# Altium schematic sheet SPECTRE_ESP32-S3.SchDoc
size A3; SheetNumber: 1; SheetTotal: 2
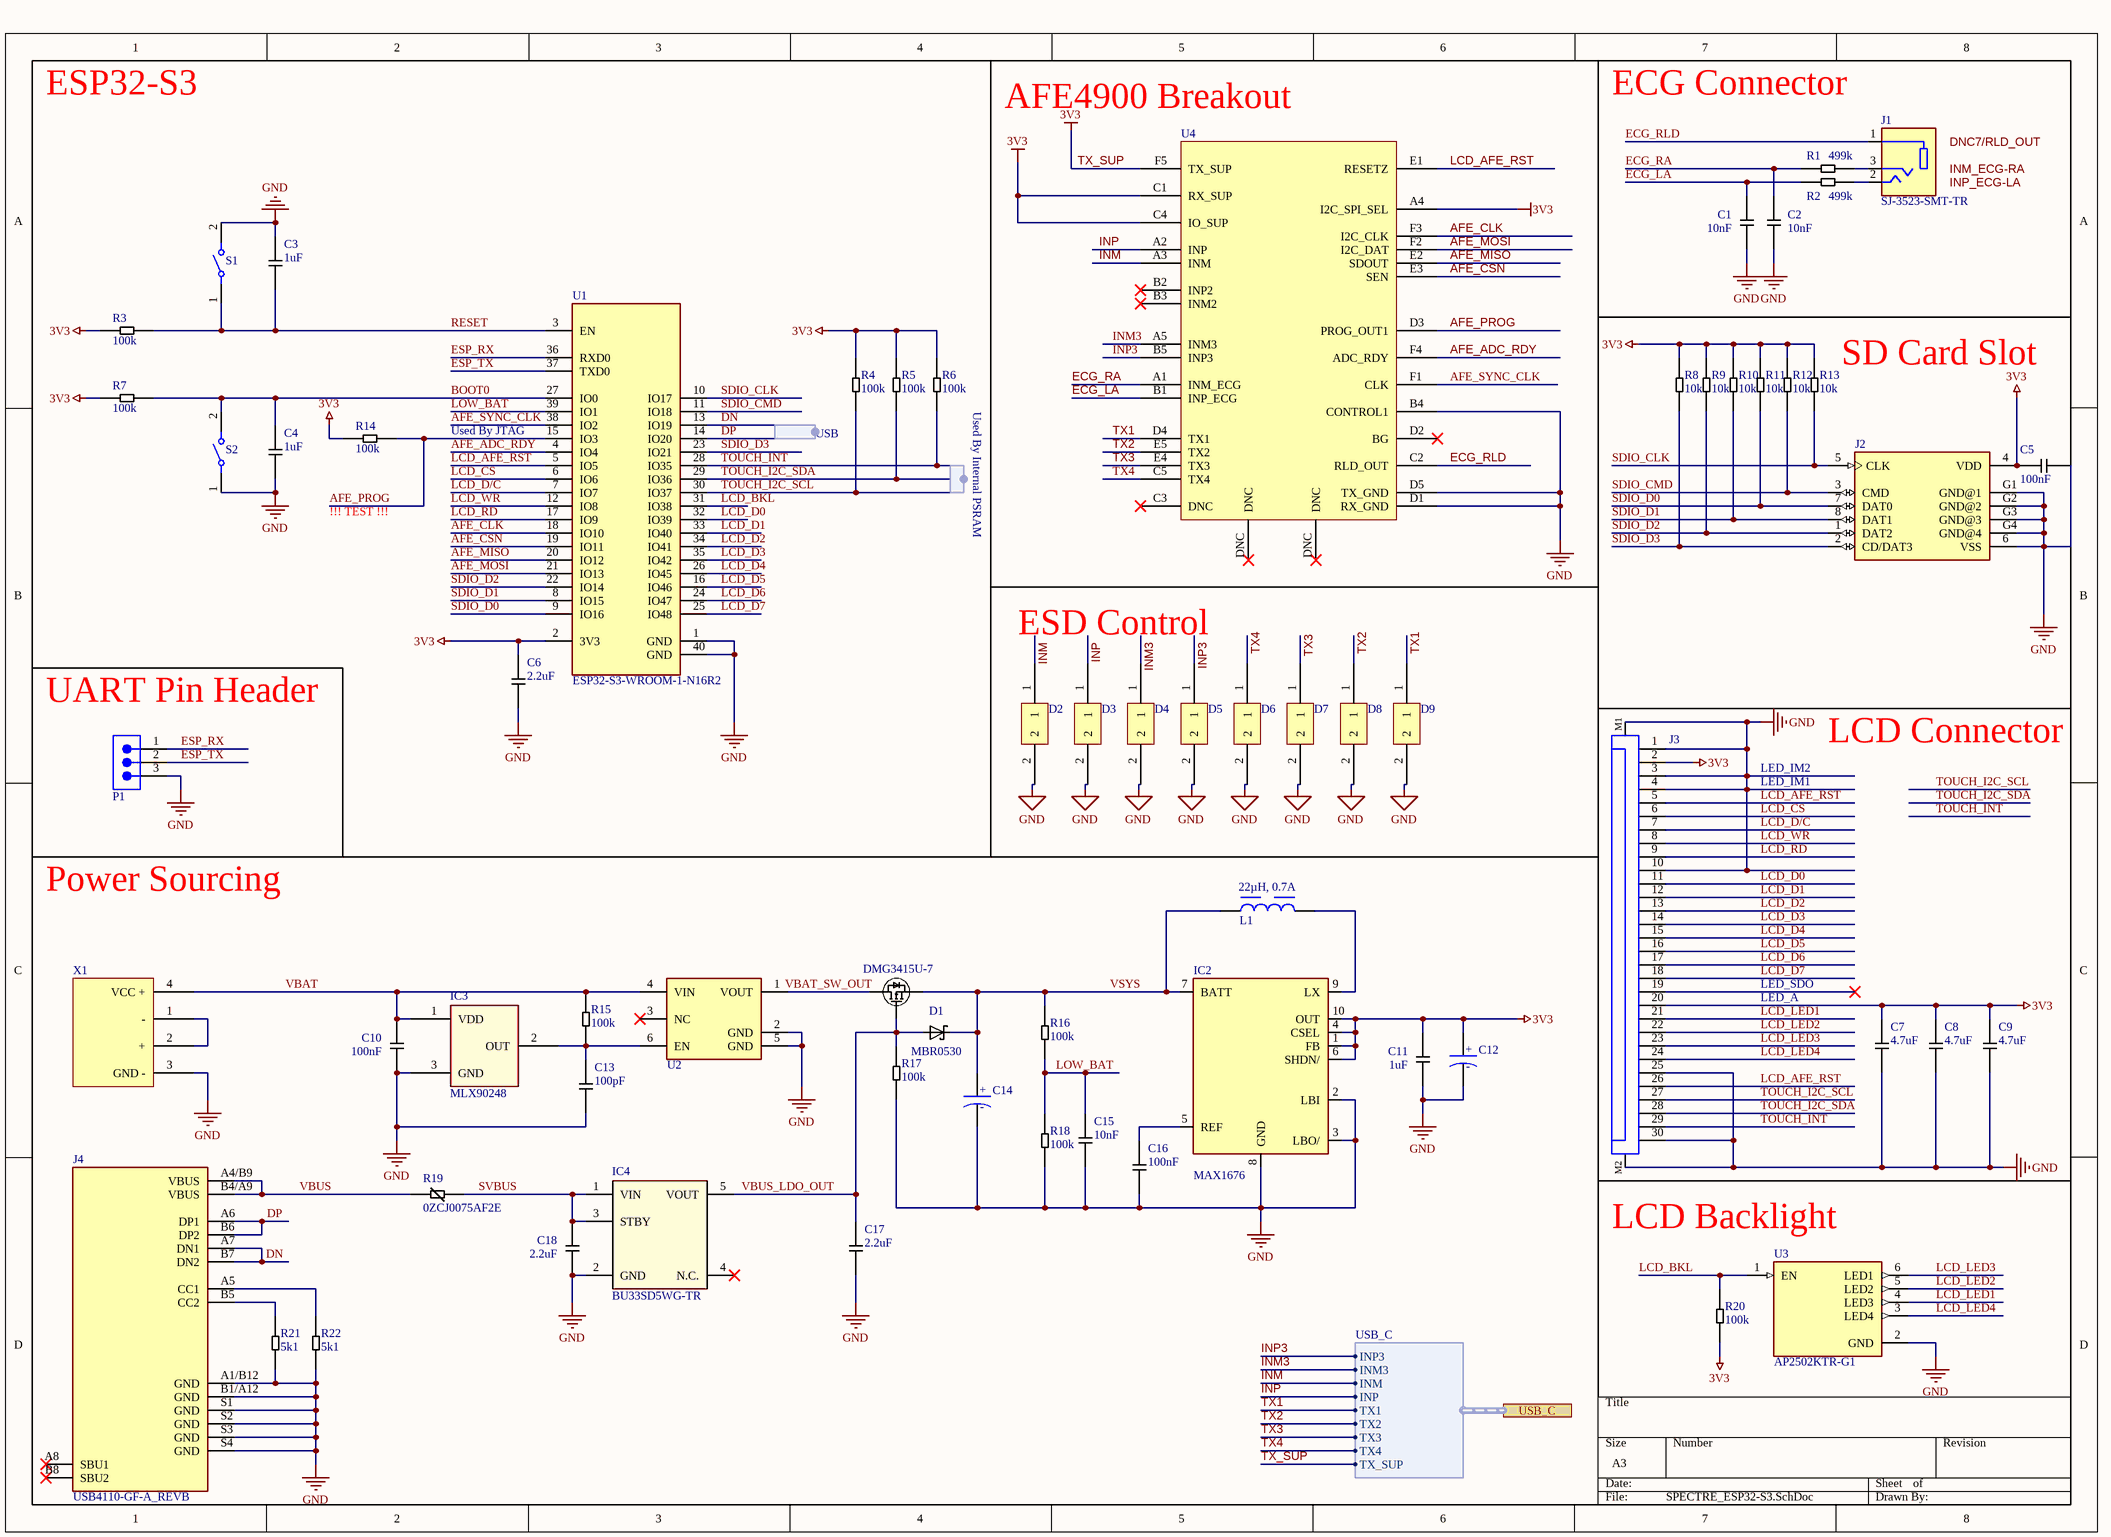
[diagram p0: SPECTRE_ESP32-S3.SchDoc]

## Parts
C1  10nF  [C_0402]
C2  10nF  [C_0402]
C3  1uF  [C_0402]
C4  1uF  [C_0402]
C5  100nF  [C_0402]
C6  2.2uF  [C_0402]
C7  4.7uF  [C_0402]
C8  4.7uF  [C_0402]
C9  4.7uF  [C_0402]
C10  100nF  [C_0402]
C11  1uF  [C_0402]
C12  TAJB476M006RNJ  [TANTAL_1210]  (value not drawn)
C13  100pF  [C_0402]
C14  TAJB476M006RNJ  [TANTAL_1210]  (value not drawn)
C15  10nF  [C_0402]
C16  100nF  [C_0402]
C17  2.2uF  [C_0402]
C18  2.2uF  [C_0402]
D1  MBR0530  [MBR0530]
D2  (no value)  [TPD1E10B06DPYR_0402 - duplicate]
D3  TPD1E10B06DPYR  [TPD1E10B06DPYR_0402 - duplicate]  (value not drawn)
D4  TPD1E10B06DPYR  [TPD1E10B06DPYR_0402 - duplicate]  (value not drawn)
D5  TPD1E10B06DPYR  [TPD1E10B06DPYR_0402 - duplicate]  (value not drawn)
D6  TPD1E10B06DPYR  [TPD1E10B06DPYR_0402 - duplicate]  (value not drawn)
D7  TPD1E10B06DPYR  [TPD1E10B06DPYR_0402 - duplicate]  (value not drawn)
D8  TPD1E10B06DPYR  [TPD1E10B06DPYR_0402 - duplicate]  (value not drawn)
D9  TPD1E10B06DPYR  [TPD1E10B06DPYR_0402 - duplicate]  (value not drawn)
FET1  DMG3415U-7  [SOT95P240X105-3N]
IC2  MAX1676  [UMAX10]
IC3  MLX90248  [SOT95P240X105-3N]
IC4  BU33SD5WG-TR  [SOT95P280X125-5N]
J1  SJ-3523-SMT-TR  [CUI_SJ-3523-SMT-TR]
J2  (no value)  [MOLEX_47219-2001]
J3  687130182122  [687130182122]  (value not drawn)
J4  USB4110-GF-A_REVB  [GCT_USB4110-GF-A_REVB]
L1  22µH, 0.7A  [WE-LQS_4018]
P1  61300311021  [61300311021]  (value not drawn)
R1  499k  [R_0402]
R2  499k  [R_0402]
R3  100k  [R_0402]
R4  100k  [R_0402]
R5  100k  [R_0402]
R6  100k  [R_0402]
R7  100k  [R_0402]
R8  10k  [R_0402]
R9  10k  [R_0402]
R10  10k  [R_0402]
R11  10k  [R_0402]
R12  10k  [R_0402]
R13  10k  [R_0402]
R14  100k  [R_0402]
R15  100k  [R_0402]
R16  100k  [R_0402]
R17  100k  [R_0402]
R18  100k  [R_0402]
R19  0ZCJ0075AF2E  [RESC3216X125N]
R20  100k  [R_0402]
R21  5k1  [R_0402]
R22  5k1  [R_0402]
S1  434153017835  [434153017835]  (value not drawn)
S2  434153017835  [434153017835]  (value not drawn)
U1  ESP32-S3-WROOM-1-N16R2  [XCVR_ESP32-S3-WROOM-1-N16R2]
U2  MIC94090YC6-TR  [Microchip_SC70-6LD-PL-1_IPC_C]  (value not drawn)
U3  AP2502KTR-G1  [SOT95P280X145-6N]
U4  (no value)  [CON - PLCC32 Fassung]
X1  SMT Battery Holder 2 Cells  [SMT Battery Holder]  (value not drawn)

## Ports
USB_C (harness USB_C)

## Harnesses
?: 
USB_C: INP, INM, INM3, INP3, TX4, TX1, TX3, TX2, TX_SUP

## Nets
GND: C1.2 C2.1 C3.2 C4.1 C5.1 C6.1 C7.1 C8.1 C9.1 C10.2 C11.1 C12.NEG C13.1 C14.NEG C15.1 C16.2 C17.1 C18.1 D2.2 D3.2 D4.2 D5.2 D6.2 D7.2 D8.2 D9.2 IC2.2(LBI) IC2.3(LBO/) IC2.8(GND) IC3.3(GND) IC4.2(GND) J2.6(VSS) J2.G1(GND@1) J2.G2(GND@2) J2.G3(GND@3) J2.G4(GND@4) J3.1 J3.3 J3.4 J3.10 J3.25 J3.30 J3.M1 J3.M2 J4.A1/B12(GND) J4.B1/A12(GND) J4.S1(GND) J4.S2(GND) J4.S3(GND) J4.S4(GND) P1.3 R17.1 R18.1 R21.1 R22.1 S1.2 S2.1 U1.1(GND) U1.40(GND) U2.2(GND) U2.5(GND) U3.2(GND) U4.B4(CONTROL1) U4.D1(RX_GND) U4.D5(TX_GND) X1.3(GND_-)
TX_SUP: C5.2 C6.2 C7.2 C8.2 C9.2 C11.2 C12.POS IC2.1(FB) IC2.4(CSEL) IC2.6(SHDN/) IC2.10(OUT) J2.4(VDD) J3.2 J3.20 R3.1 R4.2 R5.2 R6.2 R7.1 R8.2 R9.2 R10.2 R11.2 R12.2 R13.2 R14.1 R20.2 U1.2(3V3) U4.A4(I2C_SPI_SEL) U4.C1(RX_SUP) U4.C4(IO_SUP) U4.F5(TX_SUP) ; port USB_C.TX_SUP  [also labelled 3V3]
AFE_ADC_RDY: U1.4(IO4) U4.F4(ADC_RDY)
AFE_CLK: U1.18(IO10) U4.F3(I2C_CLK)
AFE_CSN: U1.19(IO11) U4.E3(SEN)
AFE_MISO: U1.20(IO12) U4.E2(SDOUT)
AFE_MOSI: U1.21(IO13) U4.F2(I2C_DAT)
AFE_PROG: R14.2 U1.15(IO3) U4.D3(PROG_OUT1)
AFE_SYNC_CLK: U1.38(IO2) U4.F1(CLK)
BOOT0: C4.2 R7.2 S2.2 U1.27(IO0)
DN: J4.A7(DN1) J4.B7(DN2) U1.13(IO19)
DP: J4.A6(DP1) J4.B6(DP2) U1.14(IO20)
ECG_LA: C1.1 R2.2 U4.B1(INP_ECG)
ECG_RA: C2.2 R1.2 U4.A1(INM_ECG)
ECG_RLD: J1.1 U4.C2(RLD_OUT)
ESP_RX: P1.1 U1.36(RXD0)
ESP_TX: P1.2 U1.37(TXD0)
INM: D2.1 U4.A3(INM) ; port USB_C.INM
INM3: D4.1 U4.A5(INM3) ; port USB_C.INM3
INP: D3.1 U4.A2(INP) ; port USB_C.INP
INP3: D5.1 U4.B5(INP3) ; port USB_C.INP3
LCD_AFE_RST: J3.5 J3.26 U1.5(IO5) U4.E1(RESETZ)
LCD_BKL: R20.1 U1.31(IO38) U3.1(EN)
LCD_CS: J3.6 U1.6(IO6)
LCD_D0: J3.11 U1.32(IO39)
LCD_D1: J3.12 U1.33(IO40)
LCD_D2: J3.13 U1.34(IO41)
LCD_D3: J3.14 U1.35(IO42)
LCD_D4: J3.15 U1.26(IO45)
LCD_D5: J3.16 U1.16(IO46)
LCD_D6: J3.17 U1.24(IO47)
LCD_D7: J3.18 U1.25(IO48)
LCD_D/C: J3.7 U1.7(IO7)
LCD_LED1: J3.21 U3.4(LED3)
LCD_LED2: J3.22 U3.5(LED2)
LCD_LED3: J3.23 U3.6(LED1)
LCD_LED4: J3.24 U3.3(LED4)
LCD_RD: J3.9 U1.17(IO9)
LCD_WR: J3.8 U1.12(IO8)
LOW_BAT: C15.2 R16.1 R18.2 U1.39(IO1)
RESET: C3.1 R3.2 S1.1 U1.3(EN)
SDIO_CLK: J2.5(CLK) R13.1 U1.10(IO17)
SDIO_CMD: J2.3(CMD) R12.1 U1.11(IO18)
SDIO_D0: J2.7(DAT0) R11.1 U1.9(IO16)
SDIO_D1: J2.8(DAT1) R10.1 U1.8(IO15)
SDIO_D2: J2.1(DAT2) R9.1 U1.22(IO14)
SDIO_D3: J2.2(CD/DAT3) R8.1 U1.23(IO21)
SVBUS: C18.2 IC4.1(VIN) IC4.3(STBY) R19.2
TOUCH_I2C_SCL: J3.27 R4.1 U1.30(IO37)
TOUCH_I2C_SDA: J3.28 R5.1 U1.29(IO36)
TOUCH_INT: J3.29 R6.1 U1.28(IO35)
TX1: D9.1 U4.D4(TX1) ; port USB_C.TX1
TX2: D8.1 U4.E5(TX2) ; port USB_C.TX2
TX3: D7.1 U4.E4(TX3) ; port USB_C.TX3
TX4: D6.1 U4.C5(TX4) ; port USB_C.TX4
VBAT: C10.1 IC3.1(VDD) R15.2 U2.4(VIN) X1.4(VCC_+)
VBAT_SW_OUT: FET1.3(D) U2.1(VOUT)
VBUS: J4.A4/B9(VBUS) J4.B4/A9(VBUS) R19.1
VBUS_LDO_OUT: C17.2 D1.A FET1.1(G) IC4.5(VOUT) R17.2
VSYS: C14.POS D1.C FET1.2(S) IC2.7(BATT) L1.1 R16.2
NetC13_2: C13.2 IC3.2(OUT) R15.1 U2.6(EN)
NetC16_1: C16.1 IC2.5(REF)
NetIC2_9: IC2.9(LX) L1.2
NetJ1_2: J1.2 R2.1
NetJ1_3: J1.3 R1.1
NetJ4_A5: J4.A5(CC1) R22.2
NetJ4_B5: J4.B5(CC2) R21.2
NetX1_1: X1.1(-) X1.2(+)

Not connected (* = marked no-connect by the designer): IC4 4(N.C.)*; J3 19*; J4 A8(SBU1)* B8(SBU2)*; U2 3(NC)*; U4 B2(INP2)* B3(INM2)* C3(DNC)* D2(BG)* DNC*

## Notes on the sheet
- ESP32-S3
- AFE4900 Breakout
- ECG Connector
- (near R13) SD Card Slot
- (near R6) Used By Internal PSRAM
- Used By JTAG
- (near R4) USB
- !!! TEST !!!
- ESD Control
- (near P1) UART Pin Header
- LCD Connector
- LED_IM1
- LED_IM2
- Power Sourcing
- LED_A
- LED_SDO
- LCD Backlight
- Labels drawn without touching a wire or pin: DNC7/RLD_OUT, INM_ECG-RA, INP_ECG-LA
- (in symbol TAJB476M006RNJ) +; -

## Library data of the parts
C1-C11 C13 C15-C18 = C_X_0402
C12 C14 = TAJB476M006RNJ: 100ÂµF Molded Tantalum Capacitors 6.3V 1411 _3528 Metric_, 1210 1.7Ohm; MF: AVX Interconnect / Elco; MP: TAJB107M006RNJ; Value: *; Package: 1210 AVX Interconnect / Elco; SnapEDA_Link: https://www.snapeda.com/parts/TAJB107M006RNJ/AVX%20Interconnect%20/%20Elco/view-part/105606/?ref=snap; Price: None; Availability: Unavailable
D2-D9 = TPD1E10B06DPYR: TPD1E10B06DPYR 0402
FET1 = DMG3415U-7: P-Channel 20V 4A _Ta_ 900mW _Ta_ Surface Mount SOT-23-3; MF: Diodes Inc.; Package: SOT-23-3 Diodes Inc.; DigiKey-Purchase-URL: https://snapeda.com/shop?store=DigiKey&id=82858; Availability: Unavailable; Value: *; MP: DMG3415U-7; Price: None; SnapEDA_Link: https://www.snapeda.com/parts/DMG3415U-7/Diodes%20Inc./view-part/82858/?ref=snap
IC2 = MAX1676: Boost Switching Regulator IC Positive Adjustable (Programmable) 2V (3.3V, 5V) 1 Output 360mA (Switch), 750mA (Switch) 10-TFSOP, 10-MSOP (0.118, 3.00mm Width); MF: Maxim Integrated; MP: MAX1676; Value: *; Availability: Unavailable; Package: None; SnapEDA_Link: https://www.snapeda.com/parts/MAX1676/Maxim%20Integrated/view-part/574462/?ref=snap; Price: None; Check_prices: https://www.snapeda.com/parts/MAX1676/Maxim%20Integrated/view-part/574462/?ref=eda
IC4 = BU33SD5WG-TR: Linear Voltage Regulator IC Positive Fixed 1 Output 500mA 5-SSOP; MF: Rohm; Check_prices: https://www.snapeda.com/parts/BU33SD5WG-TR/Rohm/view-part/?ref=eda; Value: *; SnapEDA_Link: https://www.snapeda.com/parts/BU33SD5WG-TR/Rohm/view-part/?ref=snap; Price: None; Availability: In Stock; Package: SSOP-5 Rohm; MP: BU33SD5WG-TR; Purchase-URL: https://pricing.snapeda.com/search/part/BU33SD5WG-TR/?ref=eda
J1 = SJ-3523-SMT-TR: <b>Audio Jack Connector</b> 3.5 mm Low Profile Surface Mount Stereo Jack, 3 Pin Right-Angle; Package: None; MP: SJ-3523-SMT-TR; Value: *; Availability: Unavailable; Price: None
J2 = 47219-2001: 8 Position Card Connector Secure Digital - microSDâ„¢ Surface Mount, Right Angle Gold; MF: Molex; Price: None; SnapEDA_Link: https://www.snapeda.com/parts/47219-2001/Molex/view-part/106506/?ref=snap; Package: None; Availability: Unavailable; Value: *; MP: 47219-2001
J3 = 687130182122: WR-FPC SMT ZIF Horizontal Dual Contact, pitch 0.5mm, Horizontal, 30pins; Manufacturer: Wurth Elektronik; Contact Resistance: 30mΩ; Rated Current: 0.5A; Working Voltage: 50VAC; ComponentLink1Description: Website Link; ComponentLink1URL: https://www.we-online.com/redexpert/article/687130182122?ad; ComponentLink2Description: Datasheet Link; ComponentLink2URL: https://www.we-online.com/redexpert/spec/687130182122?ad; Manufacturer Part Number: 687130182122; Category: FPC Connectors; Match Code: WR-FPC; Mount: Surface Mount; Operating Temperature Max: 85°C; Operating Temperature Min: -55°C; Packaging: Tape and Reel; Length: 17mm; Width: 3.7mm; Height: 0.96mm; Number of Pins: 30; Orientation: Horizontal; Pitch: 0.5mm
L1 = 74404042220: WE-LQS SMT Power Inductor, size 4018, 22µH, 0.7A, 0.29Ω; Manufacturer: Wurth Elektronik; Case/Size Code: 4018; Saturation Current: 1.1A; Self Resonant Frequency: 23MHz; ComponentLink1Description: Website Link; ComponentLink1URL: https://www.we-online.com/redexpert/article/74404042220?ad; ComponentLink2Description: Datasheet Link; ComponentLink2URL: https://www.we-online.com/redexpert/spec/74404042220?ad; Manufacturer Part Number: 74404042220; Category: Shielded Power Inductors; Match Code: WE-LQS; Mount: Surface Mount; Operating Temperature Max: 125°C; Operating Temperature Min: -40°C; Packaging: Tape and Reel; Length: 4mm; Width: 4mm; Height: 1.8mm; DC Resistance: 0.29Ω; Inductance: 22µH; Rated Current: 0.7A
P1 = 61300311021: WR-PHD Pin Header, THT, Angled, pitch 2.54mm, 1 Row, 3P; Manufacturer: Wurth Elektronik; Contact Resistance: 20mΩ; Rated Current: 3A; Working Voltage: 250V; Withstanding Voltage: 500V; ComponentLink1Description: Website Link; ComponentLink1URL: https://www.we-online.com/redexpert/article/61300311021?ad; ComponentLink2Description: Datasheet Link; ComponentLink2URL: https://www.we-online.com/redexpert/spec/61300311021?ad; Manufacturer Part Number: 61300311021; Category: Board-to-Board Connectors; Match Code: WR-PHD; Mount: Through Hole; Operating Temperature Max: 105°C; Operating Temperature Min: -40°C; Packaging: Bag; Gender: Pin Header; Number of Pins: 3; Number of Rows: 1; Orientation: Angled; Pitch: 2.54mm
R1-R18 R20-R22 = R_X_0402
R19 = 0ZCJ0075AF2E: 1206 SMT PPTC | 0.75 Ih | 16V; MF: Bel Fuse; Package: 1206 Bel Fuse; Value: *; MP: 0ZCJ0075AF2E; Digi-Key_Part_Number: 507-1805-1-ND; SnapEDA_Link: https://www.snapeda.com/parts/0ZCJ0075AF2E/Bel%20Fuse%20Inc./view-part/1307706/?ref=snap
S1 S2 = 434153017835: WS-TASV J-Bend SMT Tact Switch, 3.5x2.9x1.7mm, 350gf; Manufacturer: Wurth Elektronik; Rated Voltage: 12VDC; Rated Current: 50mA; Washable: No; ComponentLink1Description: Manufacturer; ComponentLink1URL: http://www.we-online.de; ComponentLink2Description: Datasheet; ComponentLink2URL: https://www.we-online.com/catalog/datasheet/434153017835.pdf; Operating Temperature: -40 to +85degC; Manufacturer Part Number: 434153017835; Published Date: November 2020; Contact Material: Stainless Steel; Size: 3.5x2.9x1.7mm; Mounting Technology: SMT; Contact Plating: Silver; Operation Force: 350gf; Packaging: Tape and Reel; Terminal Material: Copper Alloy; Terminal Plating: Silver
U1 = ESP32-S3-WROOM-1-N16R2: Bluetooth, WiFi 802.11b/g/n, Bluetooth v5.0 Transceiver Module 2.4GHz PCB Trace Surface Mount; MF: Espressif Systems; Package: None; Availability: In Stock; SnapEDA_Link: https://www.snapeda.com/parts/ESP32-S3-WROOM-1-N16R2/Espressif+Systems/view-part/?ref=snap; MP: ESP32-S3-WROOM-1-N16R2; Value: *; Purchase-URL: https://pricing.snapeda.com/search/part/ESP32-S3-WROOM-1-N16R2/?ref=eda; Price: None; Check_prices: https://www.snapeda.com/parts/ESP32-S3-WROOM-1-N16R2/Espressif+Systems/view-part/?ref=eda
U3 = AP2502KTR-G1: LED Driver IC 4 Output Linear - PWM Dimming 20mA SOT-23-6; MF: Diodes Inc.; Value: *; MP: AP2502KTR-G1; Availability: In Stock; Package: SOT-23-6 Diodes Inc.; Purchase-URL: https://pricing.snapeda.com/search/part/AP2502KTR-G1/?ref=eda; Check_prices: https://www.snapeda.com/parts/AP2502KTR-G1/Diodes+Inc./view-part/?ref=eda; Price: None; SnapEDA_Link: https://www.snapeda.com/parts/AP2502KTR-G1/Diodes+Inc./view-part/?ref=snap
U4 = IC - AFE_PLCC32_Shuttle: Synchronized_ECG_and_PPG_AFE
X1 = SMT Battery Holder 2 Cells: SMT Battery Holder, Keystone Electronics, 2 Cells AAA; Cart: https://www.digikey.de/product-detail/de/keystone-electronics/1022/36-1022-ND/2137859; Datasheet: https://www.keyelco.com/userAssets/file/M65p23.pdf
D1 = MBR0530: SnapEDA_Link: https://www.snapeda.com/parts/MBR0530/ON%20Semiconductor/view-part/2580921/?ref=snap; Value: *
J4 = USB4110-GF-A_REVB: Value: *; Availability: Unavailable; Price: None; Package: None; MP: USB4110-GF-A_REVB